# EasyEDA schematic SCH_Phyge-V.1.json
TITLE: Phyge V.1; REV: 1.0; Date: 2026-01-03; Sheet: 1/1; Drawn By: kiya868858; Company: Your Company
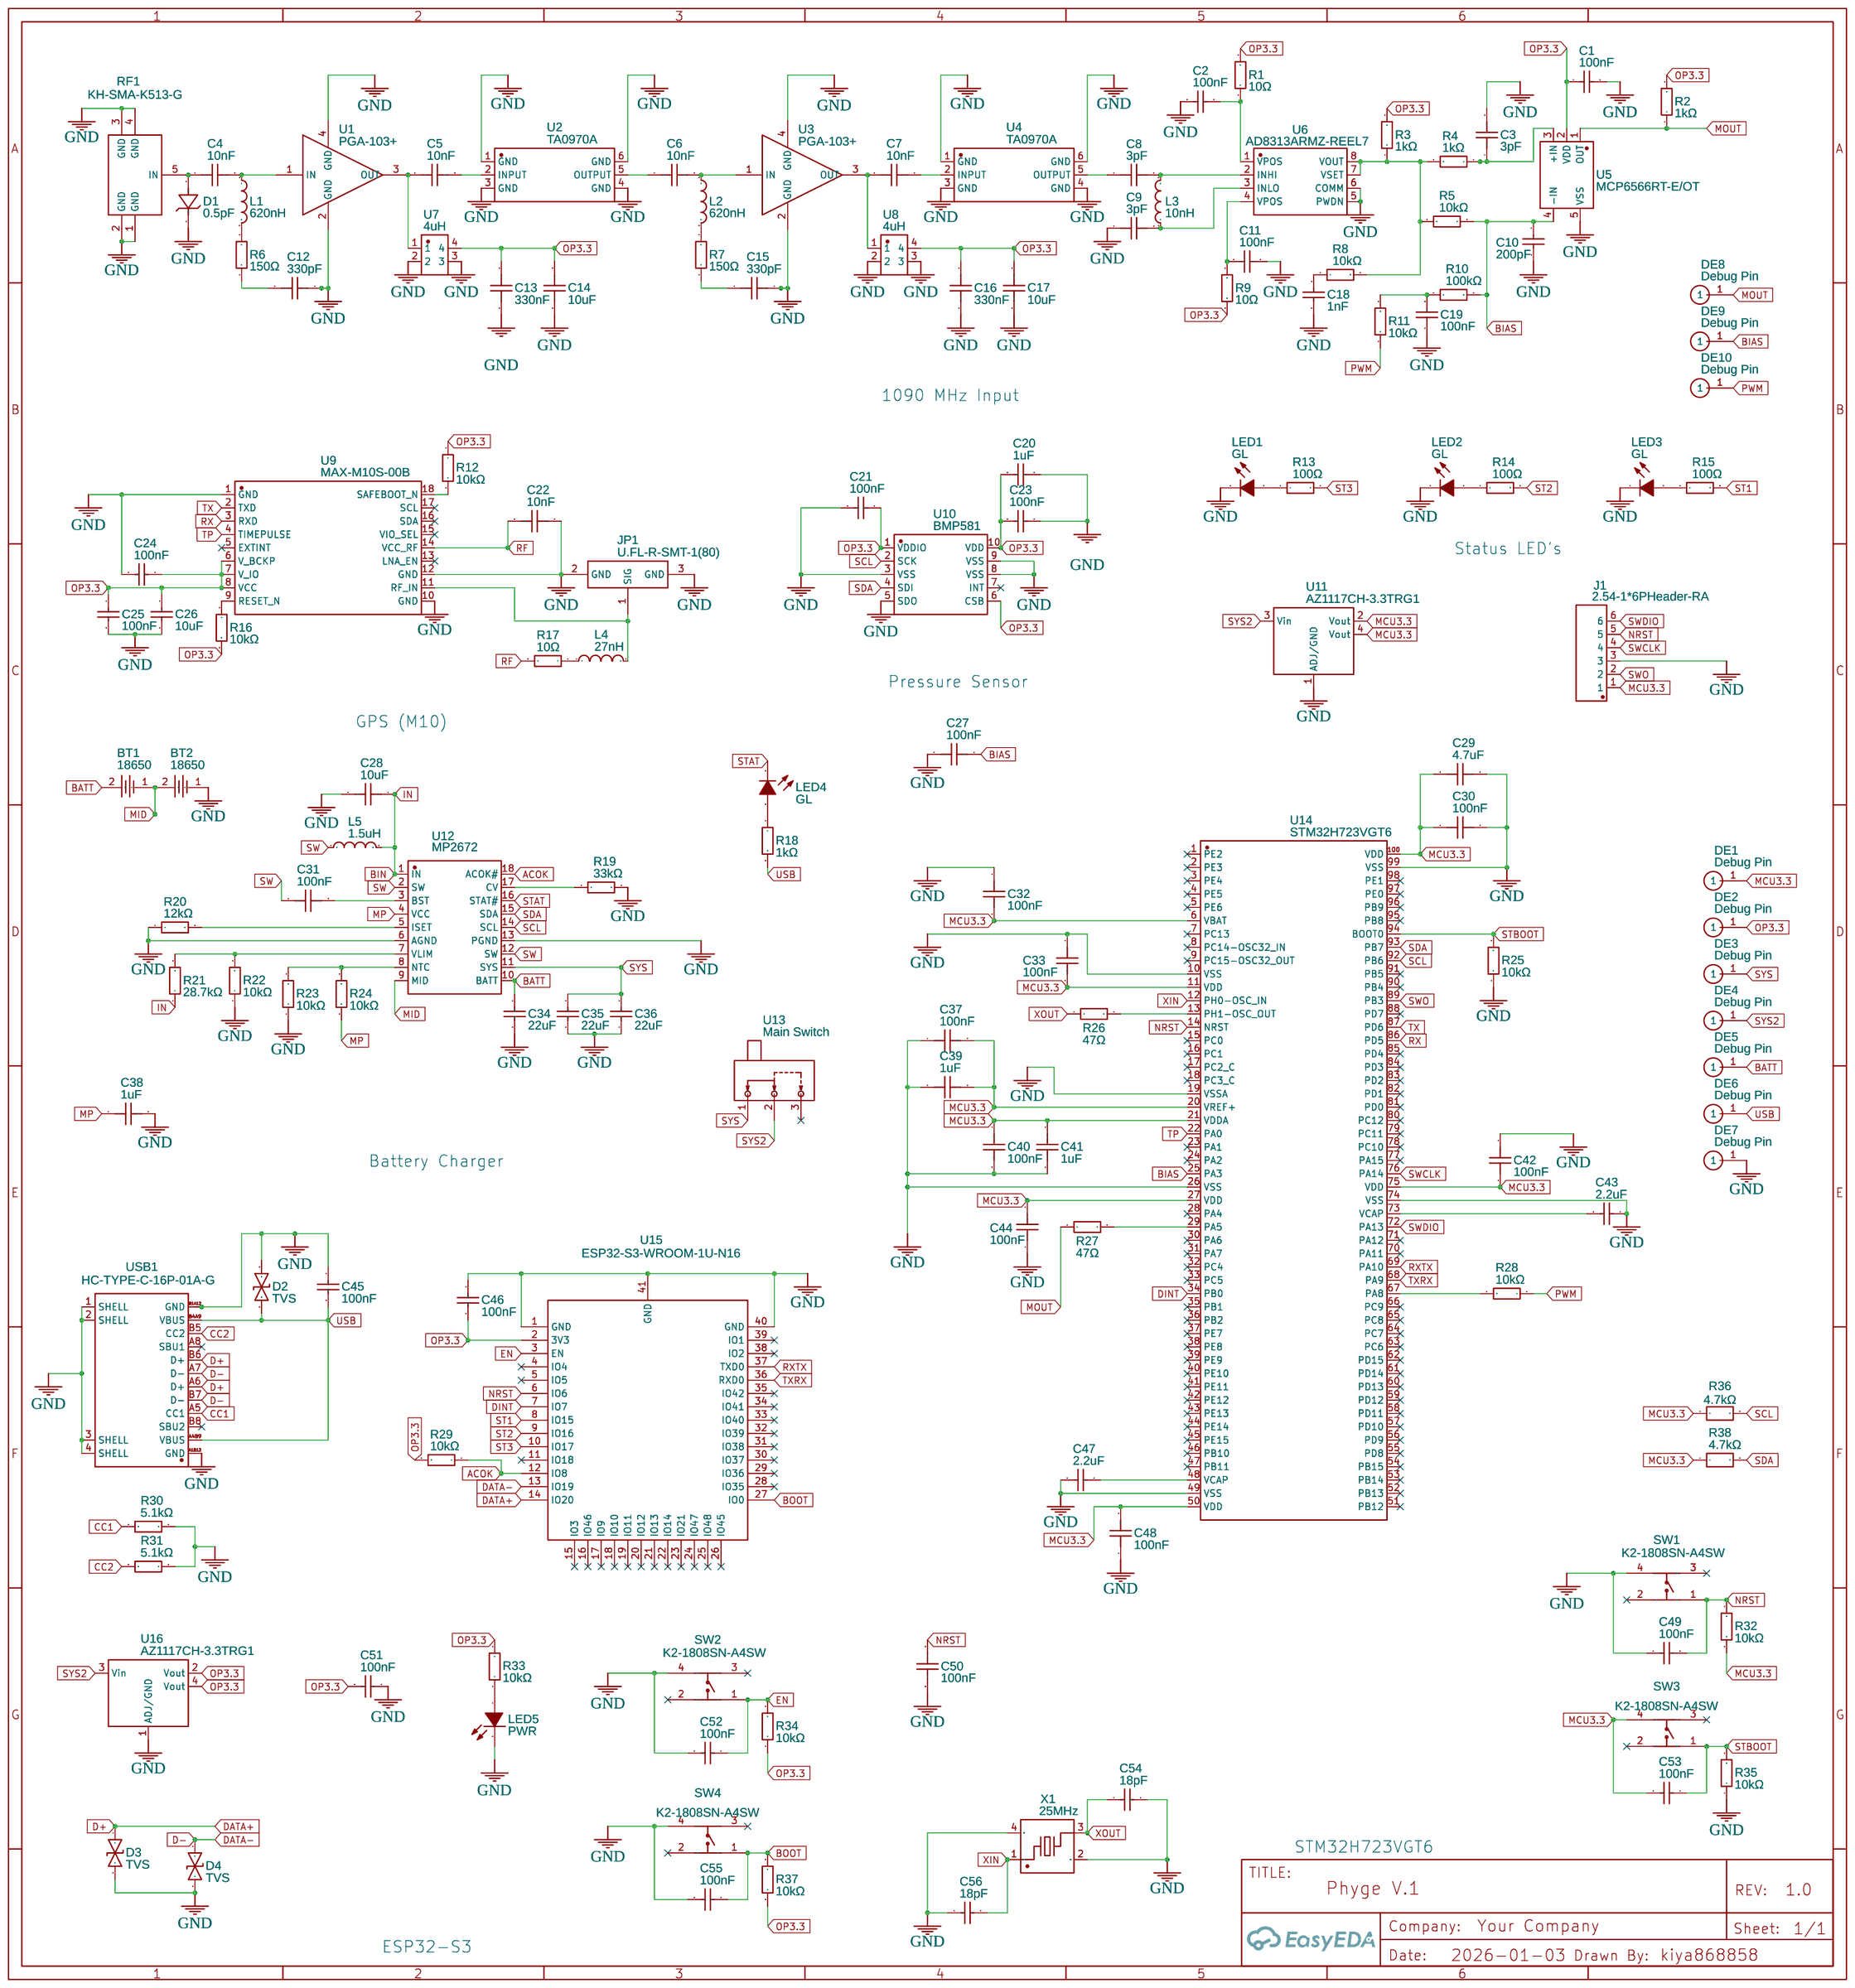
[diagram p0: schematic sheet]

## Parts
BT1  18650  [BATTERY-SMD_18650-1S-L77.1-W20.7-1]
BT2  18650  [BATTERY-SMD_18650-1S-L77.1-W20.7-1]
C1  100nF  [C0603]
C2  100nF  [C0603]
C3  3pF  [C0603]
C4  10nF  [C0805]
C5  10nF  [C0805]
C6  10nF  [C0805]
C7  10nF  [C0805]
C8  3pF  [C0603]
C9  3pF  [C0603]
C10  200pF  [C0603]
C11  100nF  [C0603]
C12  330pF  [C0603]
C13  330nF  [C1206]
C14  10uF  [C1206]
C15  330pF  [C0603]
C16  330nF  [C1206]
C17  10uF  [C1206]
C18  1nF  [C0603]
C19  100nF  [C0603]
C20  1uF  [C0805]
C21  100nF  [C0603]
C22  10nF  [C0805]
C23  100nF  [C0603]
C24  100nF  [C0603]
C25  100nF  [C0603]
C26  10uF  [C0603]
C27  100nF  [C0603]
C28  10uF  [C0603]
C29  4.7uF  [C0603]
C30  100nF  [C0603]
C31  100nF  [C0603]
C32  100nF  [C0603]
C33  100nF  [C0603]
C34  22uF  [C1206]
C35  22uF  [C1206]
C36  22uF  [C1206]
C37  100nF  [C0603]
C38  1uF  [C0603]
C39  1uF  [C0603]
C40  100nF  [C0603]
C41  1uF  [C0603]
C42  100nF  [C0603]
C43  2.2uF  [C0603]
C44  100nF  [C0603]
C45  100nF  [C0603]
C46  100nF  [C0603]
C47  2.2uF  [C0603]
C48  100nF  [C0603]
C49  100nF  [C0603]
C50  100nF  [C0603]
C51  100nF  [C0603]
C52  100nF  [C0603]
C53  100nF  [C0603]
C54  18pF  [C0603]
C55  100nF  [C0603]
C56  18pF  [C0603]
D1  0.5pF  [SOD-923_L0.9-W0.6-LS1.0]
D2  TVS  [SOD-523_L1.2-W0.8-LS1.6-BI]
D3  TVS  [SOD-523_L1.2-W0.8-LS1.6-BI]
D4  TVS  [SOD-523_L1.2-W0.8-LS1.6-BI]
DE1  Debug Pin  [DEBUG-PAD-ROUND]
DE2  Debug Pin  [DEBUG-PAD-ROUND]
DE3  Debug Pin  [DEBUG-PAD-ROUND]
DE4  Debug Pin  [DEBUG-PAD-ROUND]
DE5  Debug Pin  [DEBUG-PAD-ROUND]
DE6  Debug Pin  [DEBUG-PAD-ROUND]
DE7  Debug Pin  [DEBUG-PAD-ROUND]
DE8  Debug Pin  [DEBUG-PAD-ROUND]
DE9  Debug Pin  [DEBUG-PAD-ROUND]
DE10  Debug Pin  [DEBUG-PAD-ROUND]
J1  2.54-1*6PHeader-RA  [HDR-TH_6P-P2.54-H-M-W10.0]
JP1  U.FL-R-SMT-1(80)  [RF-SMD_FRF05002-JSS103M]
L1  620nH  [IND-SMD_L2.3-W1.7]
L2  620nH  [IND-SMD_L2.3-W1.7]
L3  10nH  [IND-SMD_L2.3-W1.7]
L4  27nH  [L0402]
L5  1.5uH  [IND-SMD_L7.2-W6.6_GPSR0730]
LED1  GL  [LED0603-RD]
LED2  GL  [LED0603-RD]
LED3  GL  [LED0603-RD]
LED4  GL  [LED0603-RD]
LED5  PWR  [LED0805-R-RD]
R1  10Ω  [R0603]
R2  1kΩ  [R0603]
R3  1kΩ  [R0603]
R4  1kΩ  [R0603]
R5  10kΩ  [R0603]
R6  150Ω  [R0603]
R7  150Ω  [R0603]
R8  10kΩ  [R0603]
R9  10Ω  [R0603]
R10  100kΩ  [R0603]
R11  10kΩ  [R0603]
R12  10kΩ  [R0603]
R13  100Ω  [R0603]
R14  100Ω  [R0603]
R15  100Ω  [R0603]
R16  10kΩ  [R0603]
R17  10Ω  [R0603]
R18  1kΩ  [R0603]
R19  33kΩ  [R0603]
R20  12kΩ  [R0603]
R21  28.7kΩ  [R0603]
R22  10kΩ  [R0603]
R23  10kΩ  [R0603]
R24  10kΩ  [R0603]
R25  10kΩ  [R0603]
R26  47Ω  [R0603]
R27  47Ω  [R0603]
R28  10kΩ  [R0603]
R29  10kΩ  [R0603]
R30  5.1kΩ  [R0805]
R31  5.1kΩ  [R0805]
R32  10kΩ  [R0603]
R33  10kΩ  [R0603]
R34  10kΩ  [R0603]
R35  10kΩ  [R0603]
R36  4.7kΩ  [R0805]
R37  10kΩ  [R0603]
R38  4.7kΩ  [R0805]
RF1  KH-SMA-K513-G  [ANT-TH_KH-SMA-K513-G]
SW1  K2-1808SN-A4SW  [KEY-SMD_4P-L4.2-W3.2-P2.20-LS5.1-TL]
SW2  K2-1808SN-A4SW  [KEY-SMD_4P-L4.2-W3.2-P2.20-LS5.1-TL]
SW3  K2-1808SN-A4SW  [KEY-SMD_4P-L4.2-W3.2-P2.20-LS5.1-TL]
SW4  K2-1808SN-A4SW  [KEY-SMD_4P-L4.2-W3.2-P2.20-LS5.1-TL]
U1  PGA-103+  [PGA-103+]
U2  TA0970A  [FILTER-SMD_6P-L3.8-W3.8-BL]
U3  PGA-103+  [PGA-103+]
U4  TA0970A  [FILTER-SMD_6P-L3.8-W3.8-BL]
U5  MCP6566RT-E/OT  [SOT-23-5_L2.9-W1.6-P0.95-LS2.8-BL]
U6  AD8313ARMZ-REEL7  [MSOP-8_L3.0-W3.0-P0.65-LS5.0-BL]
U7  4uH  [IND-SMD_4P-L3.8-W3.8]
U8  4uH  [IND-SMD_4P-L3.8-W3.8]
U9  MAX-M10S-00B  [SMD-18_L10.1-W9.7-P1.10-TL_SKG09F]
U10  BMP581  [LGA-10_L2.0-W2.0-P0.50-TL_BMP581]
U11  AZ1117CH-3.3TRG1  [SOT-223-3_L6.5-W3.4-P2.30-LS7.0-BR]
U12  MP2672  [QFN-18_L3.0-W2.0-P0.40-TL_MPQ2166GD-Z]
U13  Main Switch  [SW-TH_3P-P4.70_SS-12D06-G050]
U14  STM32H723VGT6  [LQFP-100_L14.0-W14.0-P0.50-LS16.0-BL]
U15  ESP32-S3-WROOM-1U-N16  [WIRELM-SMD_ESP32-S3-WROOM-1U]
U16  AZ1117CH-3.3TRG1  [SOT-223-3_L6.5-W3.4-P2.30-LS7.0-BR]
USB1  HC-TYPE-C-16P-01A-G  [USB-C-SMD_G-SWITCH_GT-USB-7010EN]
X1  25MHz  [CRYSTAL-SMD_4P-L3.2-W2.5-BL]

## Library data of the parts
BT1 BT2 = BH-18650-B1BA002: Contributor: lcsc; Supplier: LCSC; Supplier Part: C2988620; Manufacturer: MYOUNG(美阳); JLCPCB Part Class: Extended Part
C1 C2 C11 C19 = CC0603JRX7R9BB104: Supplier: LCSC; Manufacturer: YAGEO(国巨); Supplier Part: C91183; JLCPCB Part Class: Extended Part
C3 C8 C9 = CGA3E2C0G1H030CT0Y0N: Contributor: LCSC; Supplier: LCSC; Supplier Part: C695157; Manufacturer: TDK; JLCPCB Part Class: Extended Part
C4-C7 C22 = CC0805JRX7R9BB103: Supplier: LCSC; Manufacturer: YAGEO(国巨); Supplier Part: C58456; JLCPCB Part Class: Extended Part
C10 = 0603B201K500NT: Supplier: LCSC; Manufacturer: FH(风华); Supplier Part: C1600; JLCPCB Part Class: Extended Part
C12 C15 = CGA3E2C0G1H331JT0Y0N: Contributor: LCSC; Supplier: LCSC; Supplier Part: C338066; Manufacturer: TDK; JLCPCB Part Class: Extended Part
C13 C16 = CC1206KRX7R9BB334: Contributor: LCSC; Supplier: LCSC; Supplier Part: C274377; Manufacturer: YAGEO(国巨); JLCPCB Part Class: Extended Part
C14 C17 = CL31B106KAHNNNE: Supplier: LCSC; Manufacturer: SAMSUNG(三星); Supplier Part: C14860; JLCPCB Part Class: Extended Part
C18 = CL10B102KB8NNNC: Supplier: LCSC; Manufacturer: SAMSUNG(三星); Supplier Part: C1588; JLCPCB Part Class: Basic Part
C20 = CL21B105KOFNNNE: Supplier: LCSC; Manufacturer: SAMSUNG(三星); Supplier Part: C24123; JLCPCB Part Class: Extended Part
C21 C23-C25 C45 C46 C49 C51-C53 C55 = GRM188R71C104KA01D: Supplier: LCSC; Manufacturer: muRata(村田); Supplier Part: C45000; JLCPCB Part Class: Extended Part
C26 = C1608X5R1E106MT000E: Contributor: LCSC; Supplier: LCSC; Supplier Part: C76614; Manufacturer: TDK; JLCPCB Part Class: Extended Part
C27 C30-C33 C37 C40 C42 C44 C48 C50 = CC0603KRX7R9BB104: Supplier: LCSC; Manufacturer: YAGEO(国巨); Supplier Part: C14663; JLCPCB Part Class: Basic Part
C28 = CL10A106KP8NNNC: Supplier: LCSC; Manufacturer: SAMSUNG(三星); Supplier Part: C19702; JLCPCB Part Class: Basic Part
C29 = CL10A475KO8NNNC: Supplier: LCSC; Manufacturer: SAMSUNG(三星); Supplier Part: C19666; JLCPCB Part Class: Basic Part
C34-C36 = CL31A226KAHNNNE: Supplier: LCSC; Manufacturer: SAMSUNG(三星); Supplier Part: C12891; JLCPCB Part Class: Basic Part
C38 C39 C41 = CL10A105KB8NNNC: Supplier: LCSC; Manufacturer: SAMSUNG(三星); Supplier Part: C15849; JLCPCB Part Class: Basic Part
C43 C47 = CC0603KRX5R6BB225: Supplier: LCSC; Manufacturer: YAGEO(国巨); Supplier Part: C106213; JLCPCB Part Class: Extended Part
C54 C56 = CL10C180JB8NNNC: Supplier: LCSC; Manufacturer: SAMSUNG(三星); Supplier Part: C1647; JLCPCB Part Class: Basic Part
D1 = ESD9L5.0: Supplier: LCSC; Supplier Part: C22368686; Manufacturer: Wild Goose(威谷); Contributor: lcsc; JLCPCB Part Class: Extended Part
D2-D4 = LESD5D5.0CT1G: Contributor: LCSC; Supplier: LCSC; Supplier Part: C383211; Manufacturer: LRC(乐山无线电); JLCPCB Part Class: Extended Part
DE1-DE10 = Debug Pin: Contributor: kiya868858
J1 = 2.54-1*6PHeader-RA: Supplier: LCSC; Manufacturer: BOOMELE(博穆精密); Manufacturer Part: 2.54-1*6P反弯排针; Supplier Part: C56816; JLCPCB Part Class: Extended Part
JP1 = U.FL-R-SMT-1(80): Supplier: LCSC; Manufacturer: HRS(广濑); Supplier Part: C88374; JLCPCB Part Class: Extended Part
L1 L2 = AHW2012C-R62JTF: Supplier: LCSC; Supplier Part: C19633939; Manufacturer: APV(爱普微); JLCPCB Part Class: Extended Part; Contributor: lcsc
L3 = AHW2012C-10NJTF: Supplier: LCSC; Supplier Part: C6808026; Manufacturer: APV(爱普微); JLCPCB Part Class: Extended Part; Contributor: lcsc
L4 = MLK1005S27NJT000: Supplier: LCSC; Manufacturer: TDK; Supplier Part: C114782; JLCPCB Part Class: Extended Part
L5 = CYA0630-1.5UH: Supplier: LCSC; Supplier Part: C5189745; Manufacturer: SHOU HAN(首韩); JLCPCB Part Class: Extended Part; Contributor: lcsc
LED1-LED4 = 19-217/GHC-YR1S2/3T: Supplier: LCSC; Manufacturer: EVERLIGHT(亿光); Supplier Part: C72043; JLCPCB Part Class: Extended Part
LED5 = FC-2012HRK-620D: Supplier: LCSC; Manufacturer: 国星光电; Manufacturer Part: NCD0805R1; Supplier Part: C84256; JLCPCB Part Class: Basic Part
R1 R9 R17 = 0603WAF100JT5E: Supplier: LCSC; Manufacturer: UNI-ROYAL(厚声); Supplier Part: C22859; JLCPCB Part Class: Basic Part
R2-R4 = 0603WAF1001T5E: Supplier: LCSC; Manufacturer: UNI-ROYAL(厚声); Supplier Part: C21190; JLCPCB Part Class: Basic Part
R5 R8 R11 = 0603WAF1002T5E: Supplier: LCSC; Manufacturer: UNI-ROYAL(厚声); Supplier Part: C25804; JLCPCB Part Class: Basic Part
R6 R7 = 0603WAF1500T5E: Supplier: LCSC; Manufacturer: UNI-ROYAL(厚声); Supplier Part: C22808; JLCPCB Part Class: Basic Part
R10 = 0603WAF1003T5E: Supplier: LCSC; Manufacturer: UNI-ROYAL(厚声); Supplier Part: C25803; JLCPCB Part Class: Basic Part
R12 R16 R22-R25 R28 R29 R32-R35 R37 = 0603WAJ0103T5E: Supplier: LCSC; Manufacturer: UNI-ROYAL(厚声); Supplier Part: C15401; JLCPCB Part Class: Extended Part
R13-R15 = RT0603BRD07100RL: Supplier: LCSC; Manufacturer: YAGEO(国巨); Supplier Part: C122970; JLCPCB Part Class: Extended Part
R18 = RC0603JR-071KL: Supplier: LCSC; Manufacturer: YAGEO(国巨); Supplier Part: C14676; JLCPCB Part Class: Extended Part
R19 = 0603WAF3302T5E: Supplier: LCSC; Manufacturer: UNI-ROYAL(厚声); Supplier Part: C4216; JLCPCB Part Class: Basic Part
R20 = 0603WAF1202T5E: Supplier: LCSC; Manufacturer: UNI-ROYAL(厚声); Supplier Part: C22790; JLCPCB Part Class: Basic Part
R21 = 0603WAF2872T5E: Supplier: LCSC; Manufacturer: UNI-ROYAL(厚声); Supplier Part: C22928; JLCPCB Part Class: Extended Part
R26 R27 = 0603WAF470JT5E: Supplier: LCSC; Manufacturer: UNI-ROYAL(厚声); Supplier Part: C23182; JLCPCB Part Class: Basic Part
R30 R31 = RMC08055.1K1%N: Contributor: LCSC; Supplier: LCSC; Supplier Part: C269748; Manufacturer: Tyohm(幸亚电阻); JLCPCB Part Class: Extended Part
R36 R38 = ERJ6RBD4701V: Contributor: LCSC; Supplier: LCSC; Supplier Part: C336873; Manufacturer: PANASONIC(松下); JLCPCB Part Class: Extended Part
RF1 = KH-SMA-K513-G: Contributor: LCSC; Supplier: LCSC; Supplier Part: C411575; Manufacturer: kinghelm(金航标); JLCPCB Part Class: Extended Part
SW1-SW4 = K2-1808SN-A4SW: Supplier: LCSC; Manufacturer: 韩国韩荣; Manufacturer Part: K2-1808SN-A4SW-01; Supplier Part: C92589; JLCPCB Part Class: Extended Part
U1 U3 = PGA-103+ (1): Manufacturer: Mini-Circuits; Supplier Part: C3008207; Supplier: LCSC; link: https://www.minicircuits.com/pdfs/PGA-103+.pdf?srsltid=AfmBOooyQ4uEwYpUMsFY6gWtNfVVtkQELsU9VwNo3Ic-u9HF5VNCK4Yl; Contributor: kiya868858
U2 U4 = TA0970A: Supplier: LCSC; Supplier Part: C7115531; Manufacturer: TST(嘉硕); JLCPCB Part Class: Extended Part; Contributor: lcsc
U5 = MCP6566RT-E/OT: Contributor: LCSC; Supplier: LCSC; Supplier Part: C623507; Manufacturer: MICROCHIP(美国微芯); JLCPCB Part Class: Extended Part
U6 = AD8313ARMZ-REEL7: Contributor: LCSC; Supplier: LCSC; Supplier Part: C481897; Manufacturer: ADI(亚德诺); JLCPCB Part Class: Extended Part
U7 U8 = TCCH-80+: Supplier: LCSC; Supplier Part: C3223029; Manufacturer: Mini-Circuits; JLCPCB Part Class: Extended Part; Contributor: lcsc
U9 = MAX-M10S-00B: Contributor: lcsc; Supplier: LCSC; Supplier Part: C4153167; Manufacturer: U-BLOX; JLCPCB Part Class: Extended Part
U10 = BMP581: Supplier: LCSC; Supplier Part: C5362283; Manufacturer: Bosch(博世); JLCPCB Part Class: Extended Part; Contributor: lcsc
U11 U16 = AZ1117CH-3.3TRG1: Supplier: LCSC; Manufacturer: DIODES(美台); Supplier Part: C92102; JLCPCB Part Class: Extended Part
U12 = MP2672AGD-0000-Z: Supplier: LCSC; Supplier Part: C6674645; Manufacturer: MPS(芯源); Contributor: lcsc; JLCPCB Part Class: Extended Part
U13 = SS-12D06-G050: Supplier: LCSC; Supplier Part: C17179521; Manufacturer: G-Switch(品赞); Contributor: lcsc; JLCPCB Part Class: Extended Part
U14 = STM32H723VGT6: Contributor: LCSC; Supplier: LCSC; Supplier Part: C730142; Manufacturer: ST(意法半导体); JLCPCB Part Class: Extended Part
U15 = ESP32-S3-WROOM-1U-N16: Contributor: LCSC; Supplier: LCSC; Supplier Part: C2980298; Manufacturer: ESPRESSIF(乐鑫); JLCPCB Part Class: Extended Part
USB1 = HC-TYPE-C-16P-01A-G: Contributor: lcsc; Supplier: LCSC; Supplier Part: C2997435; Manufacturer: HCTL(华灿天禄); JLCPCB Part Class: Extended Part
X1 = XXDBBCNANF-25.000000MHZ: Contributor: LCSC; Supplier: LCSC; Supplier Part: C521600; Manufacturer: TAITIEN(泰艺电子); JLCPCB Part Class: Extended Part

## Nets
GND: BT2.1 C1.2 C2.1 C3.2 C9.1 C10.1 C11.2 C12.1 C13.1 C14.1 C15.1 C16.1 C17.1 C18.1 C19.1 C20.2 C21.1 C22.2 C23.2 C24.1 C25.2 C26.2 C27.1 C28.1 C29.2 C30.2 C32.1 C33.1 C34.1 C35.1 C36.1 C37.1 C38.2 C39.1 C40.2 C41.2 C42.2 C43.1 C44.1 C45.1 C46.2 C47.1 C48.1 C49.2 C50.1 C51.1 C52.2 C54.2 C55.2 C56.1 D1.1(C) D2.1 D3.2 D4.2 DE7.1 J1.3 JP1.2(GND) JP1.3(GND) LED1.1(C) LED2.1(C) LED3.1(C) LED5.2(-) R19.2 R20.1 R22.1 R23.1 R25.1 R30.2 R31.2 R35.1 RF1.1(GND) RF1.2(GND) RF1.3(GND) RF1.4(GND) SW1.4 SW2.4 SW4.4 U1.2(GND) U1.4(GND) U2.1(GND) U2.3(GND) U2.4(GND) U2.6(GND) U3.2(GND) U3.4(GND) U4.1(GND) U4.3(GND) U4.4(GND) U4.6(GND) U5.5(VSS) U6.5(PWDN) U6.6(COMM) U7.2 U7.3 U8.2 U8.3 U9.1(GND) U9.10(GND) U9.12(GND) U10.3(VSS) U10.5(SDO) U10.8(VSS) U10.9(VSS) U11.1(ADJ/GND) U12.6(AGND) U12.13(PGND) U14.10(VSS) U14.19(VSSA) U14.26(VSS) U14.49(VSS) U14.74(VSS) U14.99(VSS) U15.1(GND) U15.40(GND) U15.41(GND) U16.1(ADJ/GND) USB1.1(SHELL) USB1.2(SHELL) USB1.3(SHELL) USB1.4(SHELL) USB1.A1B12(GND) USB1.B1A12(GND) X1.2(GND) X1.4(GND)
ACOK: R29.1 U12.18(ACOK#) U15.12(IO8)
BATT: BT1.2 C34.2 DE5.1 U12.10(BATT)
BIAS: C10.2 C27.2 DE9.1 R5.2 R10.2 U5.4(-IN) U14.25(PA3)
BIN: C28.2 L5.2 R21.1 U12.1(IN)
BOOT: C55.1 R37.2 SW4.1 U15.27(IO0)
CC1: R30.1 USB1.A5(CC1)
CC2: R31.1 USB1.B5(CC2)
D+: D3.1 U15.14(IO20) USB1.A6(D+) USB1.B6(D+)
D-: D4.1 U15.13(IO19) USB1.A7(D-) USB1.B7(D-)
DINT: U14.34(PB0) U15.7(IO7)
EN: C52.1 R34.2 SW2.1 U15.3(EN)
MCU3.3: C29.1 C30.1 C32.2 C33.2 C37.2 C39.2 C40.1 C41.1 C42.1 C44.2 C48.2 C53.2 DE1.1 J1.1 R32.1 R36.1 R38.1 SW3.4 U11.2(Vout) U11.4(Vout) U14.6(VBAT) U14.11(VDD) U14.20(VREF+) U14.21(VDDA) U14.27(VDD) U14.50(VDD) U14.75(VDD) U14.100(VDD)
MID: BT1.1 BT2.2 U12.9(MID)
MOUT: DE8.1 R2.1 R27.1 U5.1(OUT)
MP: C38.1 R24.1 U12.4(VCC)
NRST: C49.1 C50.2 J1.5 R32.2 SW1.1 U14.14(NRST) U15.6(IO6)
OP3.3: C1.1 C13.2 C14.2 C16.2 C17.2 C20.1 C21.2 C23.1 C24.2 C25.1 C26.1 C46.1 C51.2 DE2.1 R1.2 R2.2 R3.2 R9.1 R12.1 R16.2 R29.2 R33.2 R34.1 R37.1 U5.2(VDD) U7.4 U8.4 U9.6(V_BCKP) U9.7(V_IO) U9.8(VCC) U10.1(VDDIO) U10.6(CSB) U10.10(VDD) U15.2(3V3) U16.2(Vout) U16.4(Vout)
PWM: DE10.1 R11.1 R28.1
RF: C22.1 R17.2 U9.14(VCC_RF)
RX: U9.3(RXD) U14.86(PD5)
RXTX: U14.69(PA10) U15.37(TXD0)
SCL: R36.2 U10.2(SCK) U12.14(SCL) U14.92(PB6)
SDA: R38.2 U10.4(SDI) U12.15(SDA) U14.93(PB7)
ST1: R15.2 U15.8(IO15)
ST2: R14.2 U15.9(IO16)
ST3: R13.2 U15.10(IO17)
STAT: LED4.1(C) U12.16(STAT#)
STBOOT: C53.1 R25.2 R35.2 SW3.1 U14.94(BOOT0)
SW: C31.1 L5.1 U12.2(SW) U12.12(SW)
SWCLK: J1.4 U14.76(PA14)
SWDIO: J1.6 U14.72(PA13)
SWO: J1.2 U14.89(PB3)
SYS: C35.2 C36.2 DE3.1 U12.11(SYS) U13.1
SYS2: DE4.1 U11.3(Vin) U13.2 U16.3(Vin)
TP: U9.4(TIMEPULSE) U14.22(PA0)
TX: U9.2(TXD) U14.87(PD6)
TXRX: U14.68(PA9) U15.36(RXD0)
USB: C45.2 D2.2 DE6.1 R18.2 USB1.A4B9(VBUS) USB1.B4A9(VBUS)
XIN: C56.2 U14.12(PH0-OSC_IN) X1.1
XOUT: C54.1 R26.1 X1.3
Net-(C2-2): C2.2 R1.1 U6.1(VPOS)
Net-(C3-1): C3.1 R4.1 U5.3(+IN)
Net-(C4-1): C4.1 D1.2(A) RF1.5(IN)
Net-(C4-2): C4.2 L1.1 U1.1(IN)
Net-(C5-1): C5.1 U1.3(OUT) U7.1
Net-(C5-2): C5.2 U2.2(INPUT)
Net-(C6-1): C6.1 U2.5(OUTPUT)
Net-(C6-2): C6.2 L2.1 U3.1(IN)
Net-(C7-1): C7.1 U3.3(OUT) U8.1
Net-(C7-2): C7.2 U4.2(INPUT)
Net-(C8-1): C8.1 U4.5(OUTPUT)
Net-(C8-2): C8.2 L3.2 U6.2(INHI)
Net-(C9-2): C9.2 L3.1 U6.3(INLO)
Net-(C11-1): C11.1 R9.2 U6.4(VPOS)
Net-(C12-2): C12.2 R6.1
Net-(C15-2): C15.2 R7.1
Net-(C18-2): C18.2 R8.1
Net-(C19-2): C19.2 R10.1 R11.2
Net-(C31-2): C31.2 U12.3(BST)
Net-(C43-2): C43.2 U14.73(VCAP)
Net-(C47-2): C47.2 U14.48(VCAP)
Net-(JP1-1): JP1.1(SIG) L4.2 U9.11(RF_IN)
Net-(L1-2): L1.2 R6.2
Net-(L2-2): L2.2 R7.2
Net-(L4-1): L4.1 R17.1
Net-(LED1-2): LED1.2(A) R13.1
Net-(LED2-2): LED2.2(A) R14.1
Net-(LED3-2): LED3.2(A) R15.1
Net-(LED4-2): LED4.2(A) R18.1
Net-(LED5-1): LED5.1(+) R33.1
Net-(R3-1): R3.1 R4.2 R5.1 R8.2 U6.7(VSET) U6.8(VOUT)
Net-(R12-2): R12.2 U9.18(SAFEBOOT_N)
Net-(R16-1): R16.1 U9.9(RESET_N)
Net-(R19-1): R19.1 U12.17(CV)
Net-(R20-2): R20.2 U12.5(ISET)
Net-(R21-2): R21.2 R22.2 U12.7(VLIM)
Net-(R23-2): R23.2 R24.2 U12.8(NTC)
Net-(R26-2): R26.2 U14.13(PH1-OSC_OUT)
Net-(R27-2): R27.2 U14.29(PA5)
Net-(R28-2): R28.2 U14.67(PA8)

Not connected (* = marked no-connect by the designer): SW1 2* 3*; SW2 2* 3*; SW3 2* 3*; SW4 2* 3*; U9 5(EXTINT)* 13(LNA_EN)* 15(VIO_SEL)* 16(SDA)* 17(SCL)*; U10 7(INT)*; U13 3*; U14 1(PE2)* 2(PE3)* 3(PE4)* 4(PE5)* 5(PE6)* 7(PC13)* 8(PC14-OSC32_IN)* 9(PC15-OSC32_OUT)* 15(PC0)* 16(PC1)* 17(PC2_C)* 18(PC3_C)* 23(PA1)* 24(PA2)* 28(PA4)* 30(PA6)* 31(PA7)* 32(PC4)* 33(PC5)* 35(PB1)* 36(PB2)* 37(PE7)* 38(PE8)* 39(PE9)* 40(PE10)* 41(PE11)* 42(PE12)* 43(PE13)* 44(PE14)* 45(PE15)* 46(PB10)* 47(PB11)* 51(PB12)* 52(PB13)* 53(PB14)* 54(PB15)* 55(PD8)* 56(PD9)* 57(PD10)* 58(PD11)* 59(PD12)* 60(PD13)* 61(PD14)* 62(PD15)* 63(PC6)* 64(PC7)* 65(PC8)* 66(PC9)* 70(PA11)* 71(PA12)* 77(PA15)* 78(PC10)* 79(PC11)* 80(PC12)* 81(PD0)* 82(PD1)* 83(PD2)* 84(PD3)* 85(PD4)* 88(PD7)* 90(PB4)* 91(PB5)* 95(PB8)* 96(PB9)* 97(PE0)* 98(PE1)*; U15 4(IO4)* 5(IO5)* 11(IO18)* 15(IO3)* 16(IO46)* 17(IO9)* 18(IO10)* 19(IO11)* 20(IO12)* 21(IO13)* 22(IO14)* 23(IO21)* 24(IO47)* 25(IO48)* 26(IO45)* 28(IO35)* 29(IO36)* 30(IO37)* 31(IO38)* 32(IO39)* 33(IO40)* 34(IO41)* 35(IO42)* 38(IO2)* 39(IO1)*; USB1 A8(SBU1)* B8(SBU2)*

## Notes on the sheet
- 1090 MHz Input
- Status LED's
- Pressure Sensor
- GPS (M10)
- Battery Charger
- STM32H723VGT6
- ESP32-S3
